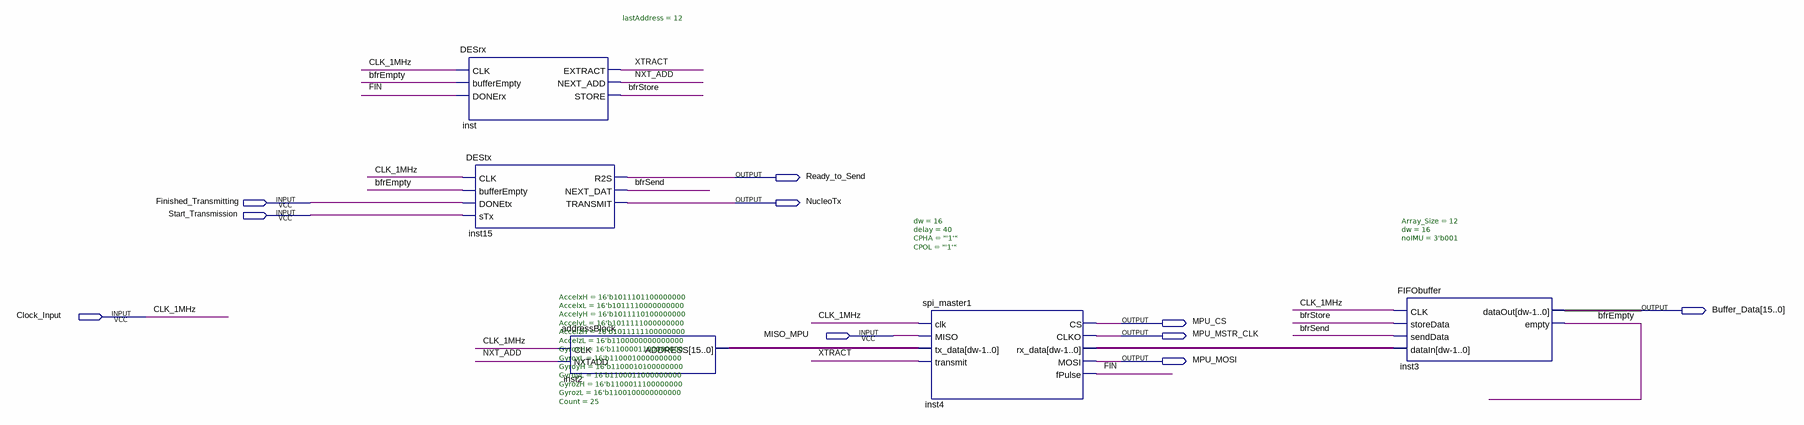
[diagram p0: schematic sheet]
// Quartus schematic IMU_Extraction_Block1.bdf as structural Verilog: 5 symbols, 10 pins
module IMU_Extraction_Block1 (
  input  Finished_Transmitting,
  input  Start_Transmission,
  input  Clock_Input,
  input  MISO_MPU,
  output Ready_to_Send,
  output NucleoTx,
  output [15:0] Buffer_Data,
  output MPU_CS,
  output MPU_MSTR_CLK,
  output MPU_MOSI
);

  wire bfrEmpty, bfrSend, bfrStore, FIN, NXT_ADD, XTRACT;
  wire [15:0] inst2_address, inst4_rx_data;

  DESrx #(.lastAddress(12)) inst (
    .CLK(Clock_Input), .bufferEmpty(bfrEmpty), .DONErx(FIN), .EXTRACT(XTRACT), .NEXT_ADD(NXT_ADD),
    .STORE(bfrStore));
  DEStx inst15 (
    .CLK(Clock_Input), .bufferEmpty(bfrEmpty), .DONEtx(Finished_Transmitting), .sTx(Start_Transmission),
    .R2S(Ready_to_Send), .NEXT_DAT(bfrSend), .TRANSMIT(NucleoTx));
  addressBlock #(.AccelxH(16'b1011101100000000), .AccelxL(16'b1011110000000000), .AccelyH(16'b1011110100000000), .AccelyL(16'b1011111000000000), .AccelzH(16'b1011111100000000), .AccelzL(16'b1100000000000000), .GyroxH(16'b1100001100000000), .GyroxL(16'b1100010000000000), .GyroyH(16'b1100010100000000), .GyroyL(16'b1100011000000000), .GyrozH(16'b1100011100000000), .GyrozL(16'b1100100000000000), .Count(25)) inst2 (
    .CLK(Clock_Input), .NXTADD(NXT_ADD), .ADDRESS(inst2_address));
  spi_master1 #(.dw(16), .delay(40), .CPHA("'1'"), .CPOL("'1'")) inst4 (
    .clk(Clock_Input), .MISO(MISO_MPU), .tx_data(inst2_address), .transmit(XTRACT), .CS(MPU_CS),
    .CLKO(MPU_MSTR_CLK), .rx_data(inst4_rx_data), .MOSI(MPU_MOSI), .fPulse(FIN));
  FIFObuffer #(.Array_Size(12), .dw(16), .noIMU(3'b001)) inst3 (
    .CLK(Clock_Input), .storeData(bfrStore), .sendData(bfrSend), .dataIn(inst4_rx_data),
    .dataOut(Buffer_Data), .empty(bfrEmpty));

  // Other names for the same wires on the sheet: CLK_1MHz = Clock_Input
endmodule
